# EAGLE schematic ram (EAGLE 9.6.2)
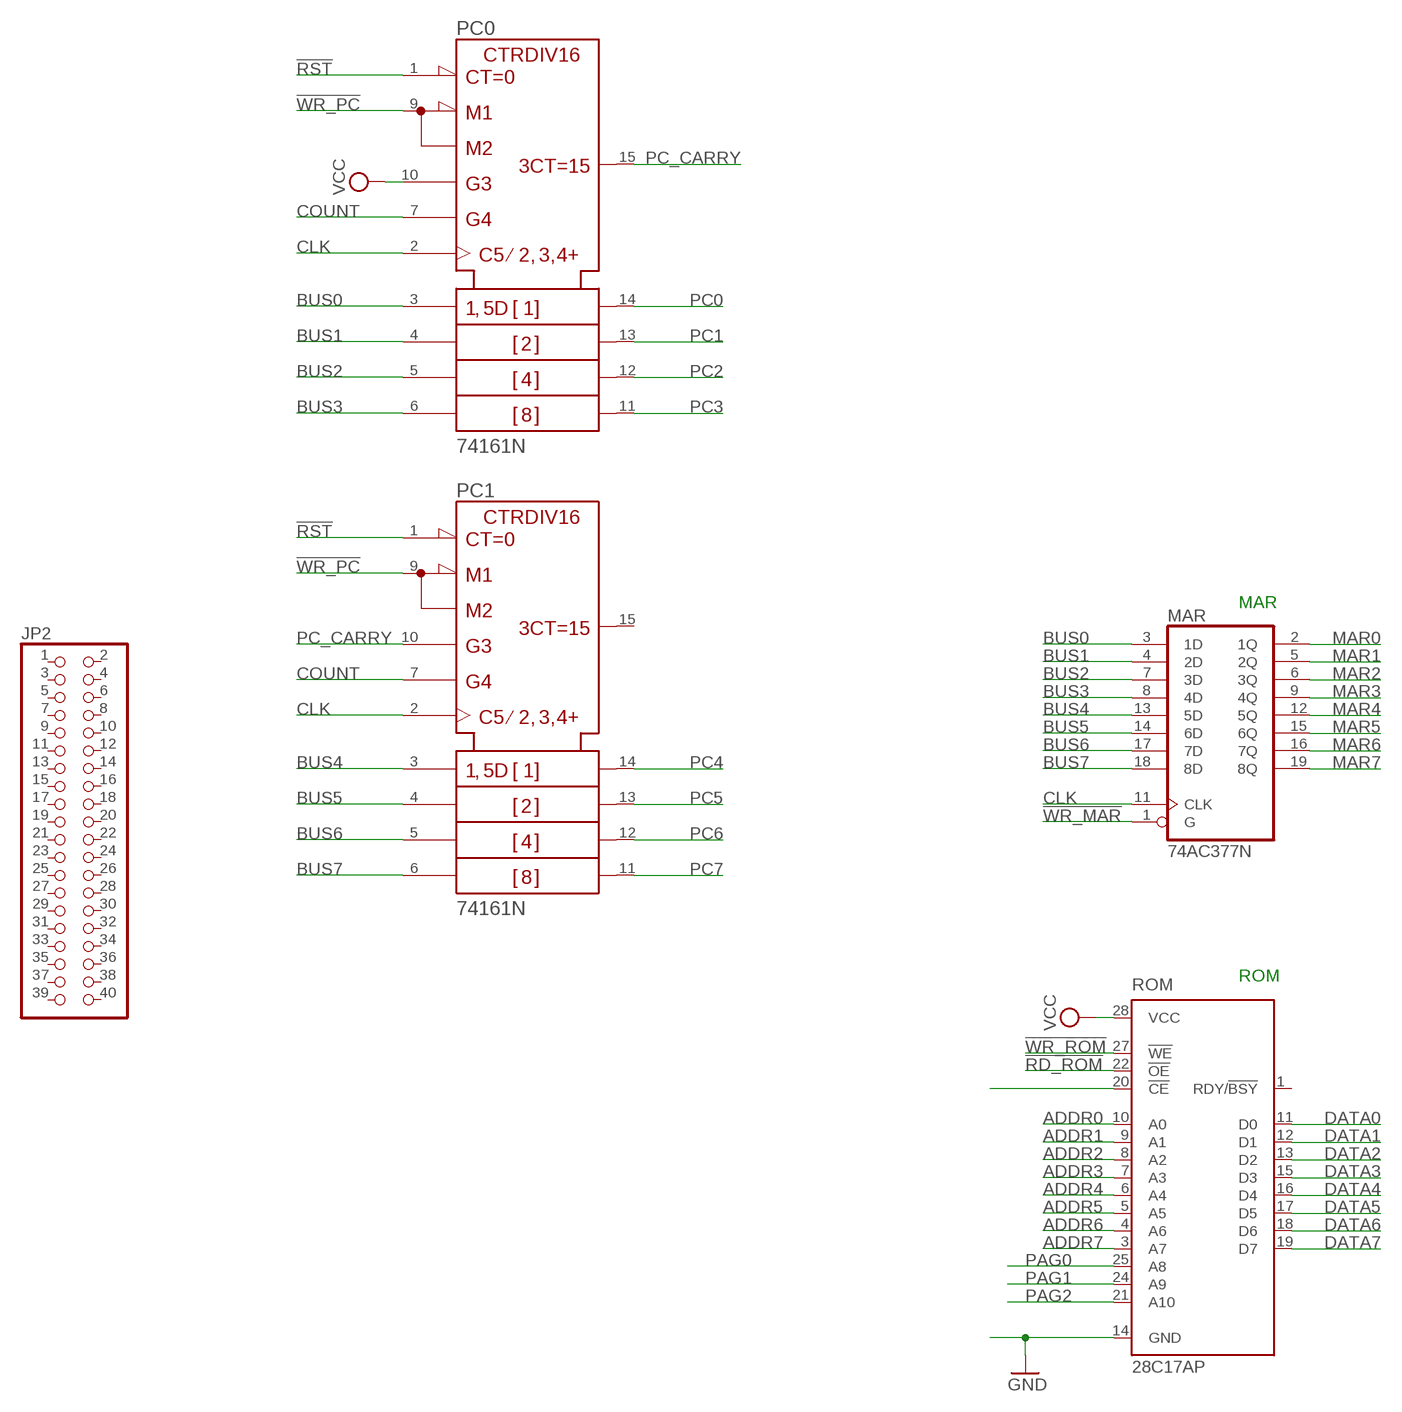
[diagram p0: schematic, sheet 1]

## Parts
JP2  PINHD-2X20/90  [2X20/90]
MAR  74AC377N  [DIL20]
PC0  74161N  [DIL16]
PC1  74161N  [DIL16]
ROM  28C17AP  [DIL28-6]

## Nets
!RD_ROM: ROM.22(!OE)
!RST: PC0.1(!CLR) PC1.1(!CLR)
!WR_MAR: MAR.1(G)
!WR_PC: PC0.9(!LOAD) PC1.9(!LOAD)
!WR_ROM: ROM.27(!WE)
ADDR0: ROM.10(A0)
ADDR1: ROM.9(A1)
ADDR2: ROM.8(A2)
ADDR3: ROM.7(A3)
ADDR4: ROM.6(A4)
ADDR5: ROM.5(A5)
ADDR6: ROM.4(A6)
ADDR7: ROM.3(A7)
BUS0: MAR.3(1D) PC0.3(A)
BUS1: MAR.4(2D) PC0.4(B)
BUS2: MAR.7(3D) PC0.5(C)
BUS3: MAR.8(4D) PC0.6(D)
BUS4: MAR.13(5D) PC1.3(A)
BUS5: MAR.14(6D) PC1.4(B)
BUS6: MAR.17(7D) PC1.5(C)
BUS7: MAR.18(8D) PC1.6(D)
CLK: MAR.11(CLK) PC0.2(CLK) PC1.2(CLK)
COUNT: PC0.7(ENP) PC1.7(ENP)
DATA0: ROM.11(D0)
DATA1: ROM.12(D1)
DATA2: ROM.13(D2)
DATA3: ROM.15(D3)
DATA4: ROM.16(D4)
DATA5: ROM.17(D5)
DATA6: ROM.18(D6)
DATA7: ROM.19(D7)
GND: ROM.14(GND) ROM.20(!CE)
MAR0: MAR.2(1Q)
MAR1: MAR.5(2Q)
MAR2: MAR.6(3Q)
MAR3: MAR.9(4Q)
MAR4: MAR.12(5Q)
MAR5: MAR.15(6Q)
MAR6: MAR.16(7Q)
MAR7: MAR.19(8Q)
PAG0: ROM.25(A8)
PAG1: ROM.24(A9)
PAG2: ROM.21(A10)
PC0: PC0.14(QA)
PC1: PC0.13(QB)
PC2: PC0.12(QC)
PC3: PC0.11(QD)
PC4: PC1.14(QA)
PC5: PC1.13(QB)
PC6: PC1.12(QC)
PC7: PC1.11(QD)
PC_CARRY: PC0.15(RCO) PC1.10(ENT)
VCC: PC0.10(ENT) ROM.28(VCC)
Unconnected: JP2.1 JP2.2 JP2.3 JP2.4 JP2.5 JP2.6 JP2.7 JP2.8 JP2.9 JP2.10 JP2.11 JP2.12 JP2.13 JP2.14 JP2.15 JP2.16 JP2.17 JP2.18 JP2.19 JP2.20 JP2.21 JP2.22 JP2.23 JP2.24 JP2.25 JP2.26 JP2.27 JP2.28 JP2.29 JP2.30 JP2.31 JP2.32 JP2.33 JP2.34 JP2.35 JP2.36 JP2.37 JP2.38 JP2.39 JP2.40 PC1.15(RCO) ROM.1(RDY/!BSY) ROM.2(NC) ROM.23(NC) ROM.26(NC)

## Notes on the sheet
- MAR
- ROM

## Power pins joined to a net without a drawn wire
+UB: PC0.16(+UB) PC1.16(+UB)
-UB: PC0.8(-UB) PC1.8(-UB)
GND: MAR.10(GND)
VCC: MAR.20(VCC)

## Library data of the parts
JP2 = pinhead:PINHD-2X20: PIN HEADER
MAR = 74xx-eu:74*377: Octal D type FLIP FLOP, enable
PC0 PC1 = 74ttl-din:74*161: Synchrounus 4-bit COUNTER
ROM = microchip:28*17A: CMOS EEPROM 16 K (2 K x 8); MPN: CAT28C17ALI20; OC_FARNELL: unknown; OC_NEWARK: 71R7405